# EAGLE design udoo (EAGLE 7.2.0)
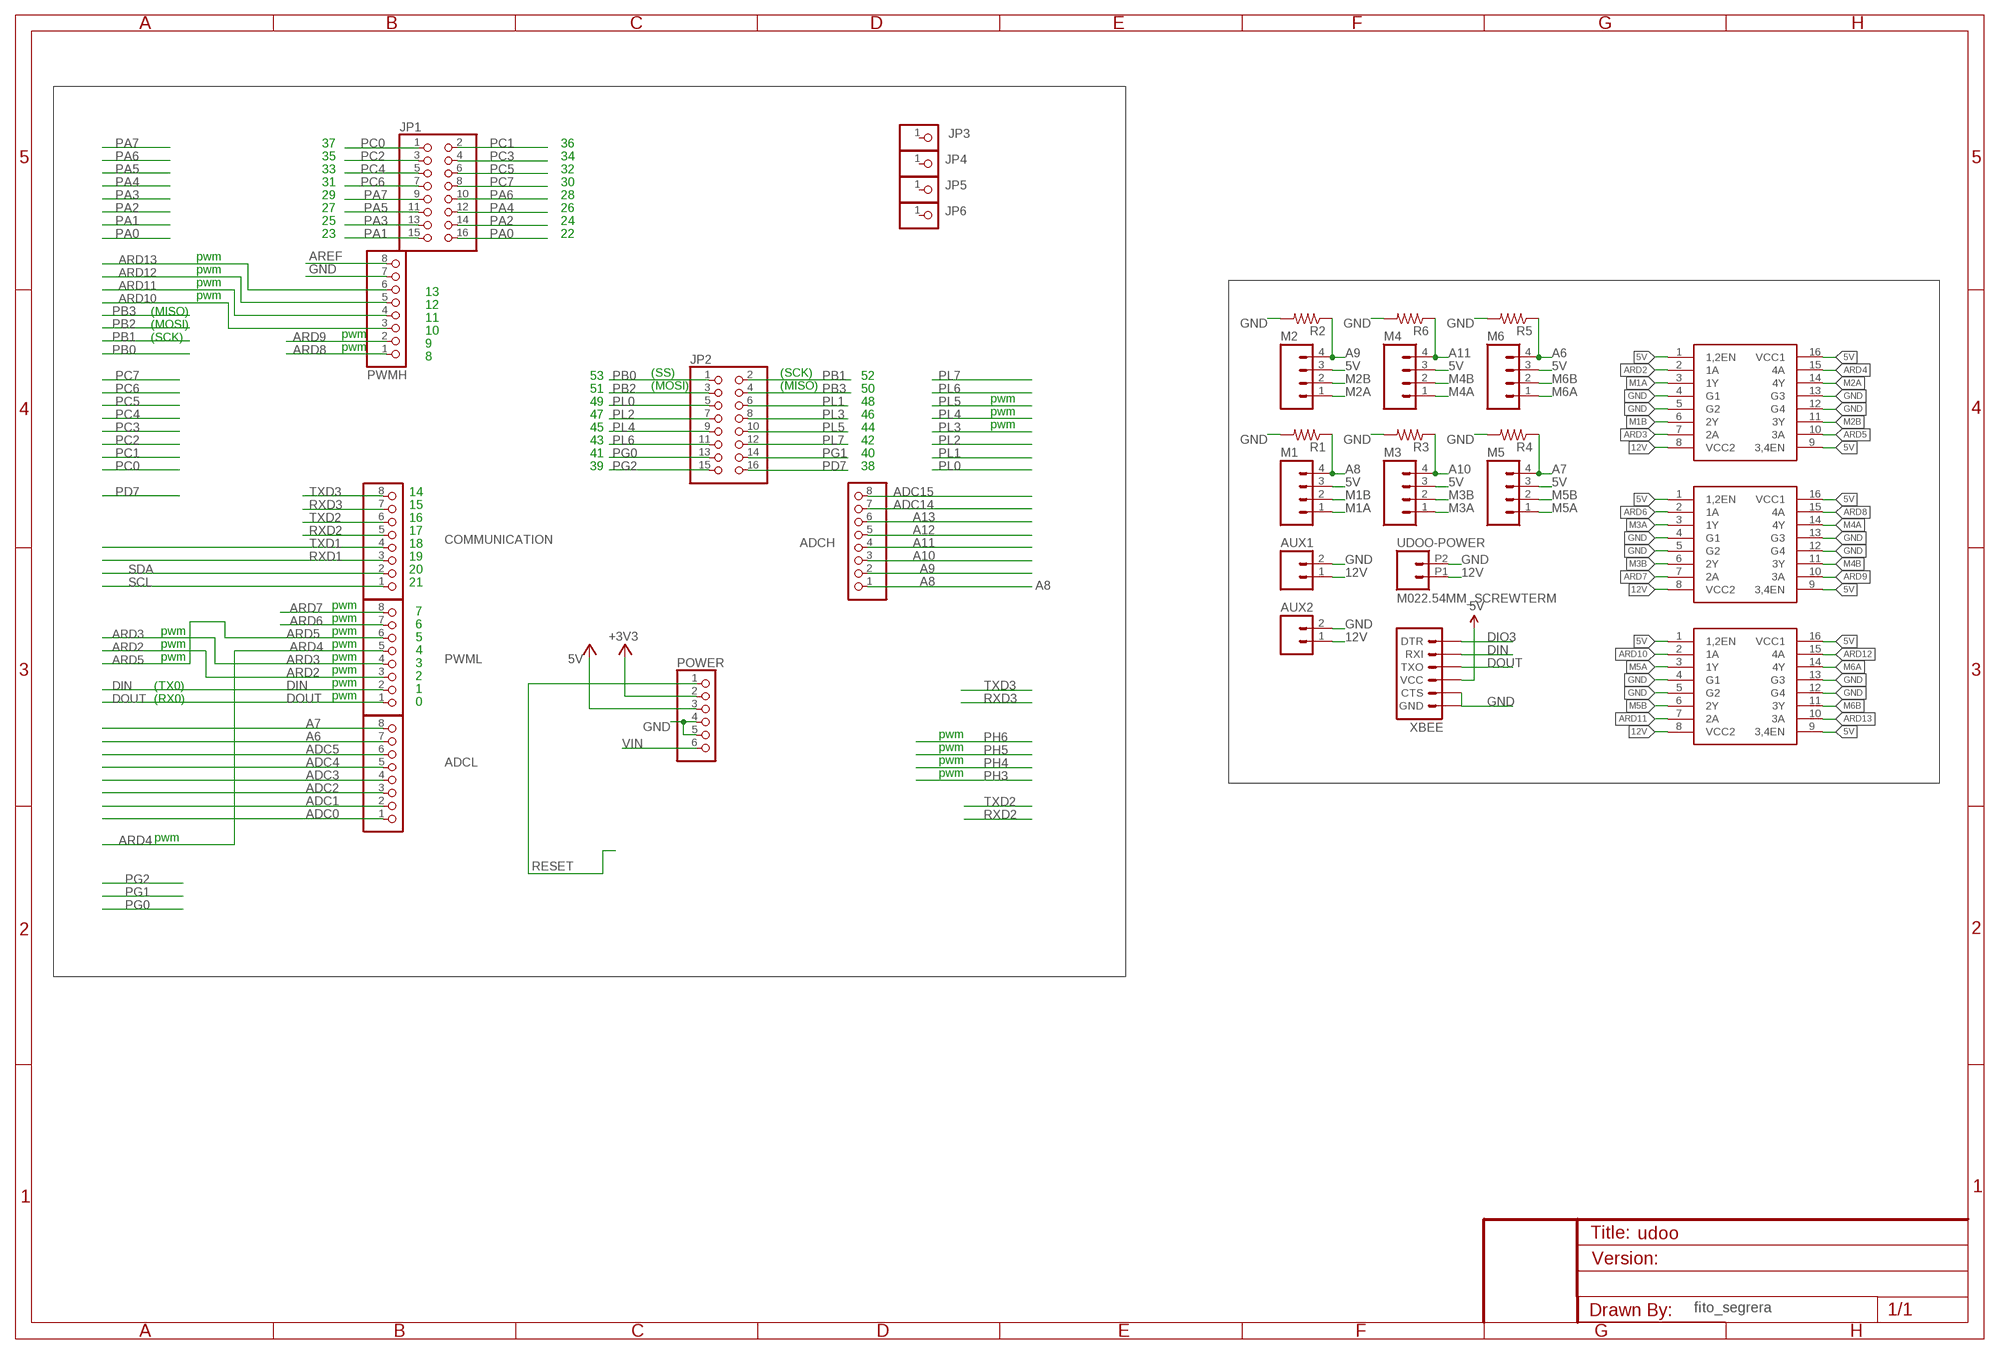
[diagram p0: schematic, sheet 1]

## Parts
ADCH  PINHD-1X8  [1X08]
ADCL  PINHD-1X8  [1X08]
AUX1  M02PTH  [1X02]
AUX2  M02PTH  [1X02]
COMMUNICATION  PINHD-1X8  [1X08]
JP1  PINHD-2X8  [2X08]
JP2  PINHD-2X8  [2X08]
JP3  PINHD-1X1  [1X01]
JP4  PINHD-1X1  [1X01]
JP5  PINHD-1X1  [1X01]
JP6  PINHD-1X1  [1X01]
M1  M04JST  [1X04-1.5MM_JST]
M2  M04JST  [1X04-1.5MM_JST]
M3  M04JST  [1X04-1.5MM_JST]
M4  M04JST  [1X04-1.5MM_JST]
M5  M04JST  [1X04-1.5MM_JST]
M6  M04JST  [1X04-1.5MM_JST]
POWER  PINHD-1X6  [1X06]
PWMH  PINHD-1X8  [1X08]
PWML  PINHD-1X8  [1X08]
R1  RESISTOR0805-RES  [0805]
R2  RESISTOR0805-RES  [0805]
R3  RESISTOR0805-RES  [0805]
R4  RESISTOR0805-RES  [0805]
R5  RESISTOR0805-RES  [0805]
R6  RESISTOR0805-RES  [0805]
U$1  HBRIDGE  [HBRIDGE]
U$2  HBRIDGE  [HBRIDGE]
U$3  HBRIDGE  [HBRIDGE]
UDOO-POWER  M022.54MM_SCREWTERM  [1X02_2.54_SCREWTERM]
XBEE  ARDUINO_SERIAL_PROGRAMPTH  [1X06]

## Nets
5V: M1.3 M2.3 M3.3 M4.3 M5.3 M6.3 POWER.3 U$1.1(1,2EN) U$1.9(3,4EN) U$1.16(VCC1) U$2.1(1,2EN) U$2.9(3,4EN) U$2.16(VCC1) U$3.1(1,2EN) U$3.9(3,4EN) U$3.16(VCC1) XBEE.4(VCC)
12V: AUX1.1 AUX2.1 U$1.8(VCC2) U$2.8(VCC2) U$3.8(VCC2) UDOO-POWER.P1
+3V3 [power]: POWER.2
A6: ADCL.7 M6.4 R5.1
A7: ADCL.8 M5.4 R4.1
A8: ADCH.1 M1.4 R1.1
A9: ADCH.2 M2.4 R2.1
A10: ADCH.3 M3.4 R3.1
A11: ADCH.4 M4.4 R6.1
A12: ADCH.5
A13: ADCH.6
ADC0: ADCL.1
ADC1: ADCL.2
ADC2: ADCL.3
ADC3: ADCL.4
ADC4: ADCL.5
ADC5: ADCL.6
ADC14: ADCH.7
ADC15: ADCH.8
ARD2: PWML.3 U$1.2(1A)
ARD3: PWML.4 U$1.7(2A)
ARD4: PWML.5 U$1.15(4A)
ARD5: PWML.6 U$1.10(3A)
ARD6: PWML.7 U$2.2(1A)
ARD7: PWML.8 U$2.7(2A)
ARD8: PWMH.1 U$2.15(4A)
ARD9: PWMH.2 U$2.10(3A)
ARD10: PWMH.3 U$3.2(1A)
ARD11: PWMH.4 U$3.7(2A)
ARD12: PWMH.5 U$3.15(4A)
ARD13: PWMH.6 U$3.10(3A)
AREF: PWMH.8
DIN: PWML.2 XBEE.2(RXI)
DIO3: XBEE.1(DTR)
DOUT: PWML.1 XBEE.3(TXO)
GND [gnd]: AUX1.2 AUX2.2 POWER.4 POWER.5 PWMH.7 R1.2 R2.2 R3.2 R4.2 R5.2 R6.2 U$1.4(G1) U$1.5(G2) U$1.12(G4) U$1.13(G3) U$2.4(G1) U$2.5(G2) U$2.12(G4) U$2.13(G3) U$3.4(G1) U$3.5(G2) U$3.12(G4) U$3.13(G3) UDOO-POWER.P2 XBEE.5(CTS) XBEE.6(GND)
M1A: M1.1 U$1.3(1Y)
M1B: M1.2 U$1.6(2Y)
M2A: M2.1 U$1.14(4Y)
M2B: M2.2 U$1.11(3Y)
M3A: M3.1 U$2.3(1Y)
M3B: M3.2 U$2.6(2Y)
M4A: M4.1 U$2.14(4Y)
M4B: M4.2 U$2.11(3Y)
M5A: M5.1 U$3.3(1Y)
M5B: M5.2 U$3.6(2Y)
M6A: M6.1 U$3.14(4Y)
M6B: M6.2 U$3.11(3Y)
PA0: JP1.16
PA1: JP1.15
PA2: JP1.14
PA3: JP1.13
PA4: JP1.12
PA5: JP1.11
PA6: JP1.10
PA7: JP1.9
PB0: JP2.1
PB1: JP2.2
PB2: JP2.3
PB3: JP2.4
PC0: JP1.1
PC1: JP1.2
PC2: JP1.3
PC3: JP1.4
PC4: JP1.5
PC5: JP1.6
PC6: JP1.7
PC7: JP1.8
PD7: JP2.16
PG0: JP2.13
PG1: JP2.14
PG2: JP2.15
PL0: JP2.5
PL1: JP2.6
PL2: JP2.7
PL3: JP2.8
PL4: JP2.9
PL5: JP2.10
PL6: JP2.11
PL7: JP2.12
RESET: POWER.1
RXD1: COMMUNICATION.3
RXD2: COMMUNICATION.5
RXD3: COMMUNICATION.7
SCL: COMMUNICATION.1
SDA: COMMUNICATION.2
TXD1: COMMUNICATION.4
TXD2: COMMUNICATION.6
TXD3: COMMUNICATION.8
VIN [power]: POWER.6
Unconnected: JP3.1 JP4.1 JP5.1 JP6.1

## Notes on the sheet
- 37 | 36
- 35 | 34
- 33 | 32
- 31 | 30
- 29 | 28
- 27 | 26
- 25 | 24
- 23 | 22
- pwm
- pwm
- pwm
- pwm | 13
- 12
- (MISO)
- 11
- (MOSI)
- pwm | 10
- (SCK)
- pwm | 9
- 8
- 53 | (SS) | (SCK) | 52
- 51 | (MOSI) | (MISO) | 50
- 49 | 48 | pwm
- 47 | 46 | pwm
- 45 | 44 | pwm
- 43 | 42
- 41 | 40
- 39 | 38
- 14
- 15
- 16
- 17
- 18
- 19
- 20
- 21
- pwm
- 7
- pwm
- 6
- pwm | pwm
- 5
- pwm | pwm
- 4
- pwm | pwm
- 3
- pwm
- 2
- (TX0) | pwm
- 1
- (RX0) | pwm
- 0
- pwm
- pwm
- pwm
- pwm
- pwm
- fito_segrera

## Library data of the parts
ADCH ADCL COMMUNICATION PWMH PWML = pinhead:PINHD-1X8: PIN HEADER
AUX1 AUX2 UDOO-POWER = SparkFun-Connectors:M02: Standard 2-pin 0.1" header. Use with - straight break away headers ( PRT-00116) - right angle break away headers (PRT-00553) - swiss pins (PRT-00743) - machine pins (PRT-00117) - female headers (PRT-00115) Molex polarized connector foot print use with: PRT-08233 with associated crimp pins and housings. 2.54_SCREWTERM for use with PRT-10571. 3.5mm Screw Terminal footprints for PRT-08084 5mm Screw Terminal footprints for use with PRT-08432
JP1 JP2 = pinhead:PINHD-2X8: PIN HEADER
JP3-JP6 = pinhead:PINHD-1X1: PIN HEADER
M1-M6 = SparkFun-Connectors:M04: Header 4 Standard 4-pin 0.1" header. Use with straight break away headers (SKU : PRT-00116), right angle break away headers (PRT-00553), swiss pins (PRT-00743), machine pins (PRT-00117), and female headers (PRT-00115). Molex polarized connector foot print use with SKU : PRT-08231 with associated crimp pins and housings. 1MM SMD Version SKU: PRT-10208
POWER = pinhead:PINHD-1X6: PIN HEADER
R1-R6 = SparkFun-Resistors:RESISTOR: Resistor Basic schematic elements and footprints for 0603, 1206, and PTH resistors.
U$1-U$3 = hbridge:HBRIDGE
XBEE = SparkFun:ARDUINO_SERIAL_PROGRAM

## Net classes
0 default: width 0.203 mm
1 power: width 0.61 mm, drill 0.711 mm, clearance 0.203 mm
2 gnd: width 0.305 mm, drill 0.711 mm, clearance 0.203 mm
3 usbvcc: width 0.508 mm, drill 0.711 mm, clearance 0.203 mm

## Board
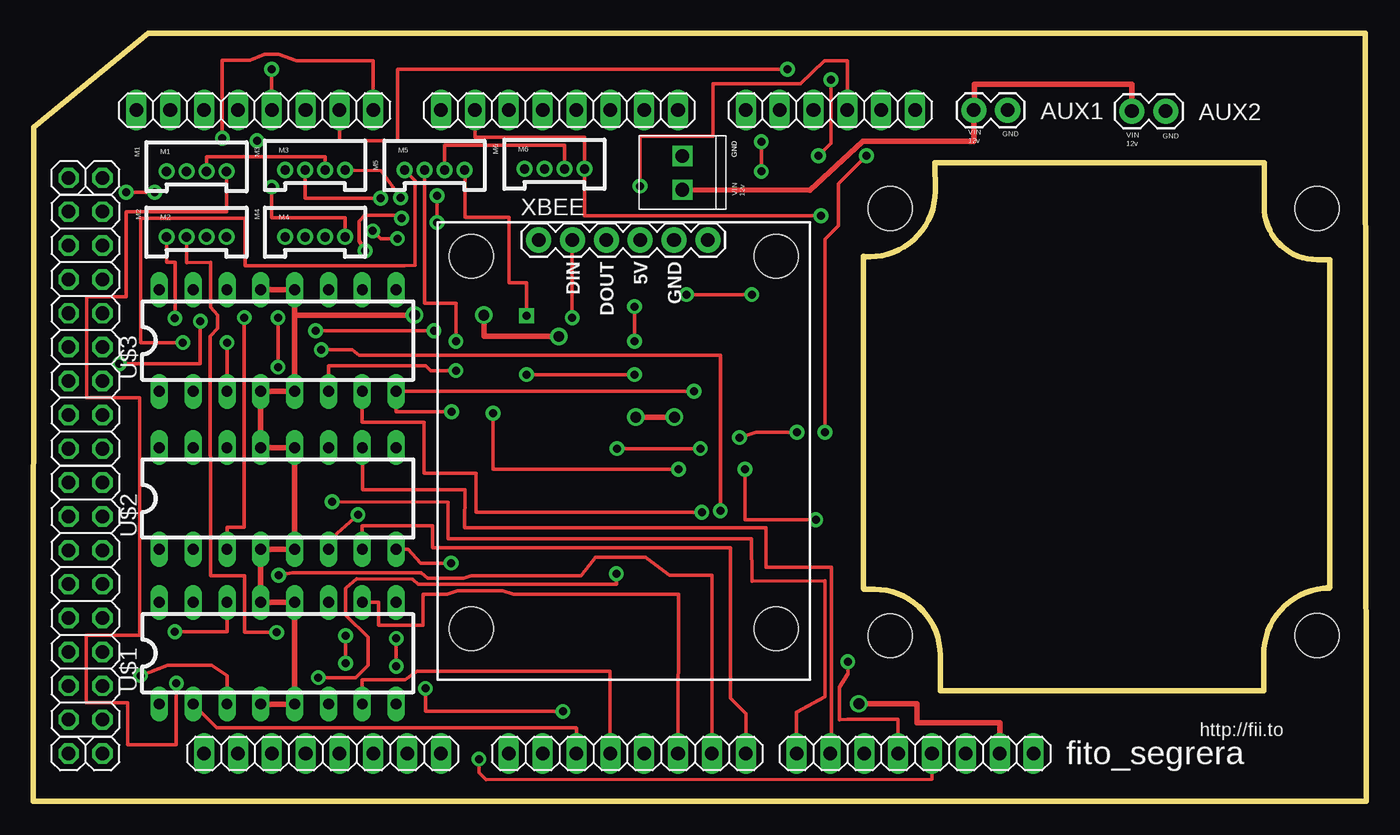
[diagram p1: board, top side]
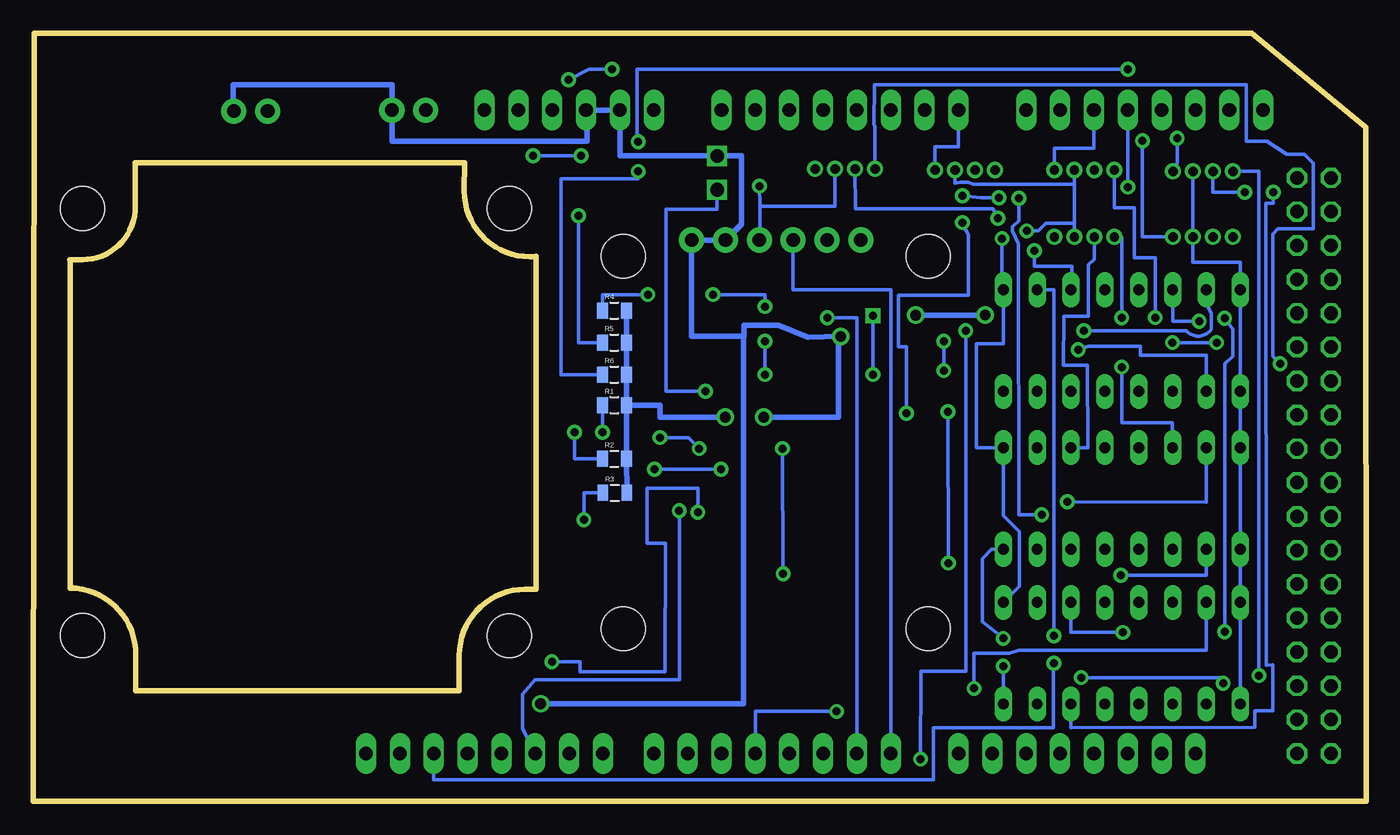
[diagram p2: board, bottom side, seen from below]

Size 100 x 57.59 mm. Coordinates in mm from the lower left corner, seen from the top.
Outline: 92.3,47.87 67.66,47.87 67.67,45.76 arc-90 62.75,40.84 62.27,40.85
Outline: 62.29,40.86 62.29,15.96
Outline: 68.07,8.3 92.27,8.3
Outline: 62.3,15.88 63.1,15.89 arc-90 68.04,10.95 68.04,8.29 68.42,8.29
Outline: 92.35,47.88 92.34,44.6 arc90 96.32,40.62 97.25,40.62
Outline: 97.26,40.62 97.25,40.62
Outline: 92.32,8.29 92.32,10.98 arc-90 97.23,15.99 97.05,16.01
Outline: 97.25,40.62 97.25,16.04
Outline: 0,0 100,0 99.93,57.59 8.6,57.59 1.08,51.4 0.02,50.54 0,0
Copper layers (1*16): Top 0.035mm / dielectric 1.5mm / Bottom 0.035mm
Design rules "default *": minimum track width 8mil, minimum drill 16mil, track to track 8mil, track to pad 8mil, pad to pad 8mil, via to via 10mil, smd to smd 8mil, copper to edge 40mil, drill to drill 12mil, minimum pad ring 10mil, minimum via ring 10mil, stop-mask expansion 4mil, vias tented up to drill 0mil, thermal gap 10mil

### Footprints (pad centres in the part's own frame; a part is rotated, then mirrored left to right if it is on the bottom)
1X08 = drill 1.016 long: 1 -8.89,0; 2 -6.35,0; 3 -3.81,0; 4 -1.27,0; 5 1.27,0; 6 3.81,0; 7 6.35,0; 8 8.89,0
1X02 = drill 1.016 pad 1.88: 1 0,0; 2 2.54,0
2X08 = drill 1.016 octagon: 1 -8.89,-1.27; 2 -8.89,1.27; 3 -6.35,-1.27; 4 -6.35,1.27; 5 -3.81,-1.27; 6 -3.81,1.27; 7 -1.27,-1.27; 8 -1.27,1.27; 9 1.27,-1.27; 10 1.27,1.27; 11 3.81,-1.27; 12 3.81,1.27; 13 6.35,-1.27; 14 6.35,1.27; 15 8.89,-1.27; 16 8.89,1.27
1X01 = drill 1.016 octagon: 1 0,0
1X04-1.5MM_JST = drill 0.7: 1 0,0; 2 1.5,0; 3 3,0; 4 4.5,0
1X06 = drill 1.016 long: 1 -6.35,0; 2 -3.81,0; 3 -1.27,0; 4 1.27,0; 5 3.81,0; 6 6.35,0
0805 = smd 0.8 x 1.2: 1 -0.9,0; 2 0.9,0
HBRIDGE = drill 0.813 long: 1 -7.62,-3.81; 2 -5.08,-3.81; 3 -2.54,-3.81; 4 0,-3.81; 5 2.54,-3.81; 6 5.08,-3.81; 7 7.62,-3.81; 8 10.16,-3.81; 9 10.16,3.81; 10 7.62,3.81; 11 5.08,3.81; 12 2.54,3.81; 13 0,3.81; 14 -2.54,3.81; 15 -5.08,3.81; 16 -7.62,3.81
STAND-OFF = hole 3.302: 0,0
1X02_2.54_SCREWTERM = drill 1.016 square: P1 2.54,0; P2 0,0
1X06' = drill 1.016 pad 1.88: 1 0,0; 2 2.54,0; 3 5.08,0; 4 7.62,0; 5 10.16,0; 6 12.7,0

### Placement (x,y rotation side)
ADCH  16.62,51.84 180 top
ADCL  39.48,51.84 180 top
AUX1  70.56,51.83 0 top
AUX2  82.42,51.76 0 top
COMMUNICATION  21.7,3.58 0 top
JP1  3.92,15.01 270 top
JP2  3.92,35.33 270 top
JP3  5.19,3.58 180 top
JP4  2.65,3.58 180 top
JP5  5.19,46.76 180 top
JP6  2.65,46.76 180 top
M1  9.99,47.24 0 top
M2  9.99,42.33 0 top
M3  18.89,47.34 0 top
M4  18.89,42.33 0 top
M5  27.85,47.34 0 top
M6  36.85,47.42 0 top
POWER  59.8,51.84 180 top
PWMH  66.15,3.58 0 top
PWML  44.56,3.58 0 top
R1  56.4,29.7 0 bottom
R2  56.4,25.68 0 bottom
R3  56.37,23.12 0 bottom
R4  56.4,36.8 0 bottom
R5  56.4,34.4 0 bottom
R6  56.4,32 0 bottom
U$1  17.07,11.1 0 top
U$2  17.07,22.7 0 top
U$3  17.07,34.55 0 top
U$4  STAND-OFF  [STAND-OFF]  64.29,12.41 270 top
U$5  STAND-OFF  [STAND-OFF]  32.87,40.87 270 top
U$6  STAND-OFF  [STAND-OFF]  64.29,44.44 270 top
U$7  STAND-OFF  [STAND-OFF]  96.3,44.44 270 top
U$8  STAND-OFF  [STAND-OFF]  96.3,12.43 270 top
U$9  STAND-OFF  [STAND-OFF]  55.73,40.87 270 top
U$10  STAND-OFF  [STAND-OFF]  55.73,12.93 270 top
U$11  STAND-OFF  [STAND-OFF]  32.87,12.93 270 top
UDOO-POWER  48.7,48.4 270 top
XBEE  [1X06']  37.91,42.09 0 top

### Tracks (layer width: path | path; a pad name or v marks a point on that pad's centre or on a via)
5V  (via drill 0.6)
  Top 0.254: M1.3 12.99,48.32 21.91,48.32 21.91,47.34 M3.3 | M5.3 30.85,49.21 39.85,49.21 M6.3 | POWER.3 61.07,55.52 59.35,55.52 57.56,53.82 50.99,53.81 50.99,49.86 45.5,49.87 v45.51,46.14 | v27.32,42.2 26.04,42.2 v25.47,42.77
  Bottom 0.254: U$1.1 U$1.16 U$2.1 U$2.16 U$3.1 U$3.16 9.45,40.41 12.99,40.41 M2.3 M1.3 | M3.3 21.89,46.27 | 21.89,46.27 21.89,43.4 | 21.89,43.4 M4.3 | M5.3 30.87,46.36 30.43,46.43 29.9,46.43 29.46,46.28 21.89,46.27 | M6.3 39.85,44.62 45.5,44.62 | 45.5,44.62 45.5,42.09 XBEE.4 | v45.51,46.14 45.5,44.62 | v27.32,42.2 27.32,38.7 U$3.9 27.23,34.31 29.26,34.31 29.26,26.52 U$2.9 27.23,21.41 26.03,20.21 26.03,16.11 U$1.9 | v25.47,42.77 24.61,42.77 24.05,43.33 21.96,43.33 21.89,43.4
12V  (via drill 0.6)
  Top 0.254: v31.38,29.21 27.23,29.21 U$3.8 v49.56,30.75 | v31.35,17.86 29.06,17.86 28.11,18.89 U$2.8 | v27.23,10.12 v27.23,12.21
  Top 0.406: UDOO-POWER.P1 58.28,45.84 62.23,49.51 70.56,49.51 AUX1.1 70.62,51.83 70.62,53.77 82.42,53.77 AUX2.1
  Bottom 0.254: v31.38,29.21 v31.35,17.86 | U$1.8 v27.23,10.12 | v27.23,12.21 28.8,13.47 28.8,18.2 28.11,18.89 U$2.8 | v49.56,30.75 52.55,30.75 52.55,44.39 48.7,44.39 UDOO-POWER.P1
A6  (via drill 0.6)
  Top 0.254: ADCL.7 33.13,49.81 41.35,49.81 M6.4 41.35,43.9 v59.1,43.9
  Bottom 0.254: R5.1 59.1,34.4 v59.1,43.9
A7  (via drill 0.6)
  Top 0.254: M5.4 32.4,47.34 32.4,43.8 35.7,43.8 35.7,38.9 37,38.9 v37,36.4 | v37,32 v45.1,32 | v45.1,34.5 v45.1,37.1 | v49,38 v53.9,38
  Bottom 0.254: M5.4 32.34,49.1 30.59,49.1 ADCL.8 | v37,36.4 v37,32 | v45.1,32 v45.1,34.5 | v45.1,37.1 45.1,38 v49,38 | v53.9,38 57.3,38 R4.1
A8  (via drill 0.6)
  Top 0.254: v14.18,49.73 14.17,55.56 16.26,55.56 17.36,56.04 18.39,56.04 19.77,55.55 25.48,55.55 ADCH.1 | M1.4 14.49,44.21 6.98,44.21 6.98,37.83 4.01,37.83 4.01,30.25 7.97,30.25 7.97,12.43 3.96,12.43 3.96,7.37 7.07,7.37 7.07,4.24 10.73,4.24 v10.73,8.84 | v21.38,9.27 24.18,9.27 25.1,10.19 25.1,12.29 23.43,13.96 23.43,15.97 24.25,16.67 28.47,16.65 28.88,16.27 43.74,16.28 v43.74,17.06 | v43.79,26.45 v50.04,26.45 | v52.99,27.27 54.21,27.67 v57.3,27.67
  Bottom 0.254: M1.4 14.18,47.88 v14.18,49.73 | v10.73,8.84 10.73,9.27 v21.38,9.27 | v43.74,17.06 43.76,17.1 v43.79,26.45 | v50.04,26.45 50.86,27.27 v52.99,27.27 | v57.3,27.67 R1.1
A9  (via drill 0.6)
  Top 0.254: v16.78,49.53 22.97,49.53 | 22.97,49.53 ADCH.2 | v59.39,27.68 59.39,42.14 60.41,43.16 60.41,46.32 v62.5,48.41 | v58.9,48.41 59.85,49.36 v59.84,54.1 | v56.58,54.9 27.34,54.9 27.34,49.53 22.97,49.53
  Bottom 0.254: M2.4 16.78,42.33 v16.78,49.53 | R2.1 59.39,25.68 v59.39,27.68 | v62.5,48.41 v58.9,48.41 | v59.84,54.1 58.3,54.9 v56.58,54.9
A10  (via drill 0.6)
  Top 0.254: v58.7,21.11 53.4,21.11 v53.4,24.9 | v48.4,24.9 34.5,24.9 v34.5,29.1 | v30.3,43.4 v30.3,45.4 | v27.55,45.26 26.1,47.3 M3.4
  Bottom 0.254: M3.4 23.39,48.99 20.42,48.99 ADCH.3 | R3.1 58.69,23.12 v58.7,21.11 | v53.4,24.9 v48.4,24.9 | v34.5,29.1 34.5,34.1 35.1,34.1 35.11,37.93 29.84,37.93 29.85,42.43 v30.3,43.4 | v30.3,45.4 28.92,45.26 v27.55,45.26
A11  (via drill 0.6)
  Top 0.254: M4.4 23.39,43.77 17.88,43.77 v17.89,46.06 | v54.62,47.23 v54.62,49.46 | v17.88,54.89 ADCH.4
  Bottom 0.254: v17.89,46.06 ADCH.4 | R6.1 60.39,32 60.39,46.69 54.62,46.69 v54.62,47.23 | v54.62,49.46 54.7,49.54 54.69,54.89 27.17,54.91 v17.88,54.89
ARD2
  Top 0.254: U$1.2 13.77,5.51 40.7,5.51 40.75,5.46 PWML.3
ARD3
  Top 0.254: U$1.7 24.68,9.1 27.91,9.1 28.8,9.75 43.26,9.75 43.26,3.58 PWML.4
ARD4  (via drill 0.6)
  Top 0.254: v39.73,6.73 29.42,6.73 v29.42,8.46
  Bottom 0.254: PWML.5 45.83,6.73 v39.73,6.73 | v29.42,8.46 29.43,11.1 26.76,11.09 26.04,11.32 11.98,11.34 U$1.15
ARD5
  Top 0.254: PWML.6 48.39,15.52 36.03,15.53 35.21,15.78 31.83,15.79 31.03,15.52 29.25,15.52 29.25,13.18 25.89,13.19 25.9,14.93 U$1.10
ARD6  (via drill 0.6)
  Top 0.254: PWML.7 50.91,16.95 47.72,16.96 45.93,18.29 42.18,18.3 41.1,16.92 32.83,16.92 32.29,16.73 29.58,16.73 29.11,17.13 19.43,17.13 v18.41,16.95
  Bottom 0.254: v18.41,16.95 11.98,16.95 U$2.2
ARD7
  Top 0.254: PWML.8 53.45,6.56 52.3,7.71 52.3,19.02 29.97,19.02 29.97,20.66 24.68,20.66 U$2.7
ARD8  (via drill 0.6)
  Top 0.254: PWMH.1 57.26,6.67 59.39,7.82 59.41,16.52 53.9,16.51 53.89,19.67 31.12,19.67 31.11,22.42 v22.41,22.45
  Bottom 0.254: v22.41,22.45 11.98,22.44 U$2.15
ARD9
  Top 0.254: PWMH.2 59.79,3.82 59.89,4.24 59.88,17.53 54.97,17.55 54.96,20.51 32.37,20.51 32.38,23.35 24.69,23.35 U$2.10
ARD10  (via drill 0.6)
  Top 0.254: v51.54,21.79 51.54,33.44 24.45,33.46 23.93,33.85 v21.61,33.85
  Bottom 0.254: PWMH.3 63.28,5.48 63.29,8.02 62.34,9.1 51.51,9.1 51.51,21.79 v51.54,21.79 | v21.61,33.85 20.86,34.12 16.94,34.12 16.94,33.44 11.98,33.44 U$3.2
ARD11  (via drill 0.6)
  Top 0.254: PWMH.4 64.88,6.13 61.09,6.13 60.48,6.12 60.47,8.53 61.1,9.55 v61.1,10.45 | v50.15,21.68 33.23,21.68 33.23,24.6 29.3,24.6 29.3,28.43 24.68,28.43 U$3.7
  Bottom 0.254: v61.1,10.45 58.99,10.45 58.99,9.71 52.59,9.71 52.56,19.35 53.94,19.35 53.94,23.47 50.15,23.47 v50.15,21.68
ARD12  (via drill 0.6)
  Top 0.254: PWMH.5 67.42,1.64 33.95,1.6 33.43,2.12 v33.43,3.16 | v30.05,35.29 v21.18,35.29
  Bottom 0.254: v33.43,3.16 33.42,9.75 30.02,9.75 30.03,28.86 30.04,30.85 v30.05,35.29 | v21.18,35.29 13.5,35.29 arc-98 11.7,35.29 11.62,35.43 11.62,36.58 11.99,37.31 U$3.15
ARD13  (via drill 0.6)
  Top 0.254: v23.44,10.34 v23.44,12.41
  Bottom 0.254: PWMH.6 69.96,1.6 32.47,1.6 32.47,5.51 23.47,5.51 23.47,10.34 v23.44,10.34 | v23.44,12.41 23.43,38.35 U$3.10
DIN  (via drill 0.6)
  Top 0.254: v40.43,36.26 40.43,42.09 XBEE.2
  Bottom 0.254: PWML.2 38.21,36.26 v40.43,36.26
DOUT
  Bottom 0.254: PWML.1 35.67,38.37 42.99,38.37 XBEE.3
GND  (via drill 0.8)
  Top 0.406: U$1.4 U$1.5 U$1.12 U$1.13 U$2.4 U$2.5 U$2.12 U$2.13 U$3.4 U$3.5 19.61,36.44 | 19.61,36.44 U$3.12 U$3.13 | v39.42,34.86 33.8,34.86 v33.8,36.45 | v28.6,36.46 19.61,36.44 | PWMH.7 72.5,5.9 66.3,5.9 66.3,7.31 v61.94,7.31 | v48.1,28.8 v45.2,28.8
  Bottom 0.406: AUX2.2 84.99,51.76 84.99,53.75 73.1,53.75 AUX1.2 73.1,49.51 58.47,49.51 58.47,51.84 POWER.4 POWER.5 55.99,48.4 UDOO-POWER.P2 46.88,48.4 46.88,43.28 XBEE.5 XBEE.6 50.61,34.86 46.69,34.86 | 46.69,34.86 46.7,35.7 44.1,35.7 41.9,34.8 v39.42,34.86 39.6,34.86 39.6,28.8 v45.2,28.8 | v33.8,36.45 v28.6,36.46 | v61.94,7.31 46.73,7.31 46.73,34.72 46.69,34.86 | R4.2 R5.2 | R5.2 R6.2 | R3.2 R2.2 R1.2 | R1.2 53,29.7 53,28.8 v48.1,28.8 | R1.2 55.5,28.5 | R1.2 R5.2
M1A  (via drill 0.6)
  Top 0.254: v8.04,9.42 10.08,10.2 13.38,10.2 14.53,9.42 U$1.3
  Bottom 0.254: M1.1 8.04,47.24 v8.04,9.42
M1B  (via drill 0.6)
  Top 0.254: v9.11,45.67 v6.96,45.67
  Bottom 0.254: M1.2 11.49,45.67 v9.11,45.67 | v6.96,45.67 6.97,44.86 7.52,44.85 7.49,10.19 7,10.23 7,6.78 8.35,6.79 8.35,5.53 22.16,5.52 U$1.6
M2A  (via drill 0.6)
  Top 0.254: M2.1 9.99,40.41 10.63,40.41 v10.63,36.22 v10.62,36.22 | v10.62,12.71 14.53,12.71 U$1.14
  Bottom 0.254: v10.62,36.22 10.01,35.38 10.01,33.38 10.59,32.8 v10.62,12.71
M2B  (via drill 0.6)
  Top 0.254: M2.2 11.49,40.4 13.29,40.41 13.29,37.06 13.84,36.44 13.84,35.46 13.26,34.88 13.3,16.92 15.86,16.92 15.86,12.66 v18.25,12.66
  Bottom 0.254: v18.25,12.66 22.14,12.66 U$1.11
M3A  (via drill 0.6)
  Top 0.254: v15.83,36.27 15.83,20.53 14.54,20.53 U$2.3
  Bottom 0.254: M3.1 18.88,44.52 17.4,44.52 17.4,40.76 15.83,40.76 v15.83,36.27
M3B  (via drill 0.6)
  Top 0.254: M3.2 20.39,45.23 v26.06,45.23 | v24.35,21.49 22.14,19.54 U$2.6
  Bottom 0.254: v26.06,45.23 26.06,43.52 26.53,43.07 26.53,42.77 26.09,41.81 26.09,40.97 26.06,21.49 v24.35,21.49
M4A  (via drill 0.6)
  Top 0.254: v18.35,36.26 v18.35,32.56
  Bottom 0.254: M4.1 18.35,42.31 v18.35,36.26 | v18.35,32.56 18.35,28.38 14.53,28.38 U$2.14
M4B
  Bottom 0.254: M4.2 20.39,40.66 20.83,40.22 20.83,36.38 22.7,36.38 22.71,32.68 20.91,32.68 20.9,26.52 U$2.11
M5A  (via drill 0.6)
  Top 0.254: M5.1 28.65,46.54 28.65,40.18 27.85,40.17 15.88,40.17 15.88,43.74 8.05,43.74 | 8.04,43.74 8.05,43.74 | 8.05,43.74 8.05,34.4 v11.22,34.4 | v14.53,34.4 U$3.3
  Bottom 0.254: v11.22,34.4 v14.53,34.4
M5B  (via drill 0.6)
  Top 0.254: M5.2 29.35,37.36 31.71,37.36 v31.7,34.49 | v31.7,32.3 29.79,32.3 29.42,32.67 22.14,32.67 U$3.6
  Bottom 0.254: v31.7,34.49 v31.7,32.3
M6A  (via drill 0.6)
  Top 0.254: v6.46,32.81 12.53,32.81 v12.53,35.99
  Bottom 0.254: M6.1 36.85,50.62 36.95,50.72 36.91,53.75 8.99,53.75 8.99,49.49 7.46,49.49 5.97,48.51 4.66,48.51 3.98,47.83 3.98,42.93 6.63,42.93 7.02,42.54 7.02,33.37 v6.46,32.81 | v12.53,35.99 14.53,35.99 U$3.14
M6B  (via drill 0.6)
  Top 0.254: v27.63,43.73 27.23,43.93 24.87,43.93 24.43,43.49 24.43,42.02 v24.89,41.28
  Bottom 0.254: M6.2 38.33,44.42 28,44.42 v27.63,43.73 | v24.89,41.28 24.89,40.14 22.08,40.14 22.08,38.35 U$3.11

### Text on the board
tPlace: DIN | DOUT | 5V | GND
tNames: GND | GND | VIN / 12v | VIN / 12v | M1 | M3 | M6 | GND | GND | M5 | VIN | 12v | M2 | M4 | http://fii.to | fito_segrera